# EAGLE board AeroQuad32 (EAGLE 5.11), part 1 of 2
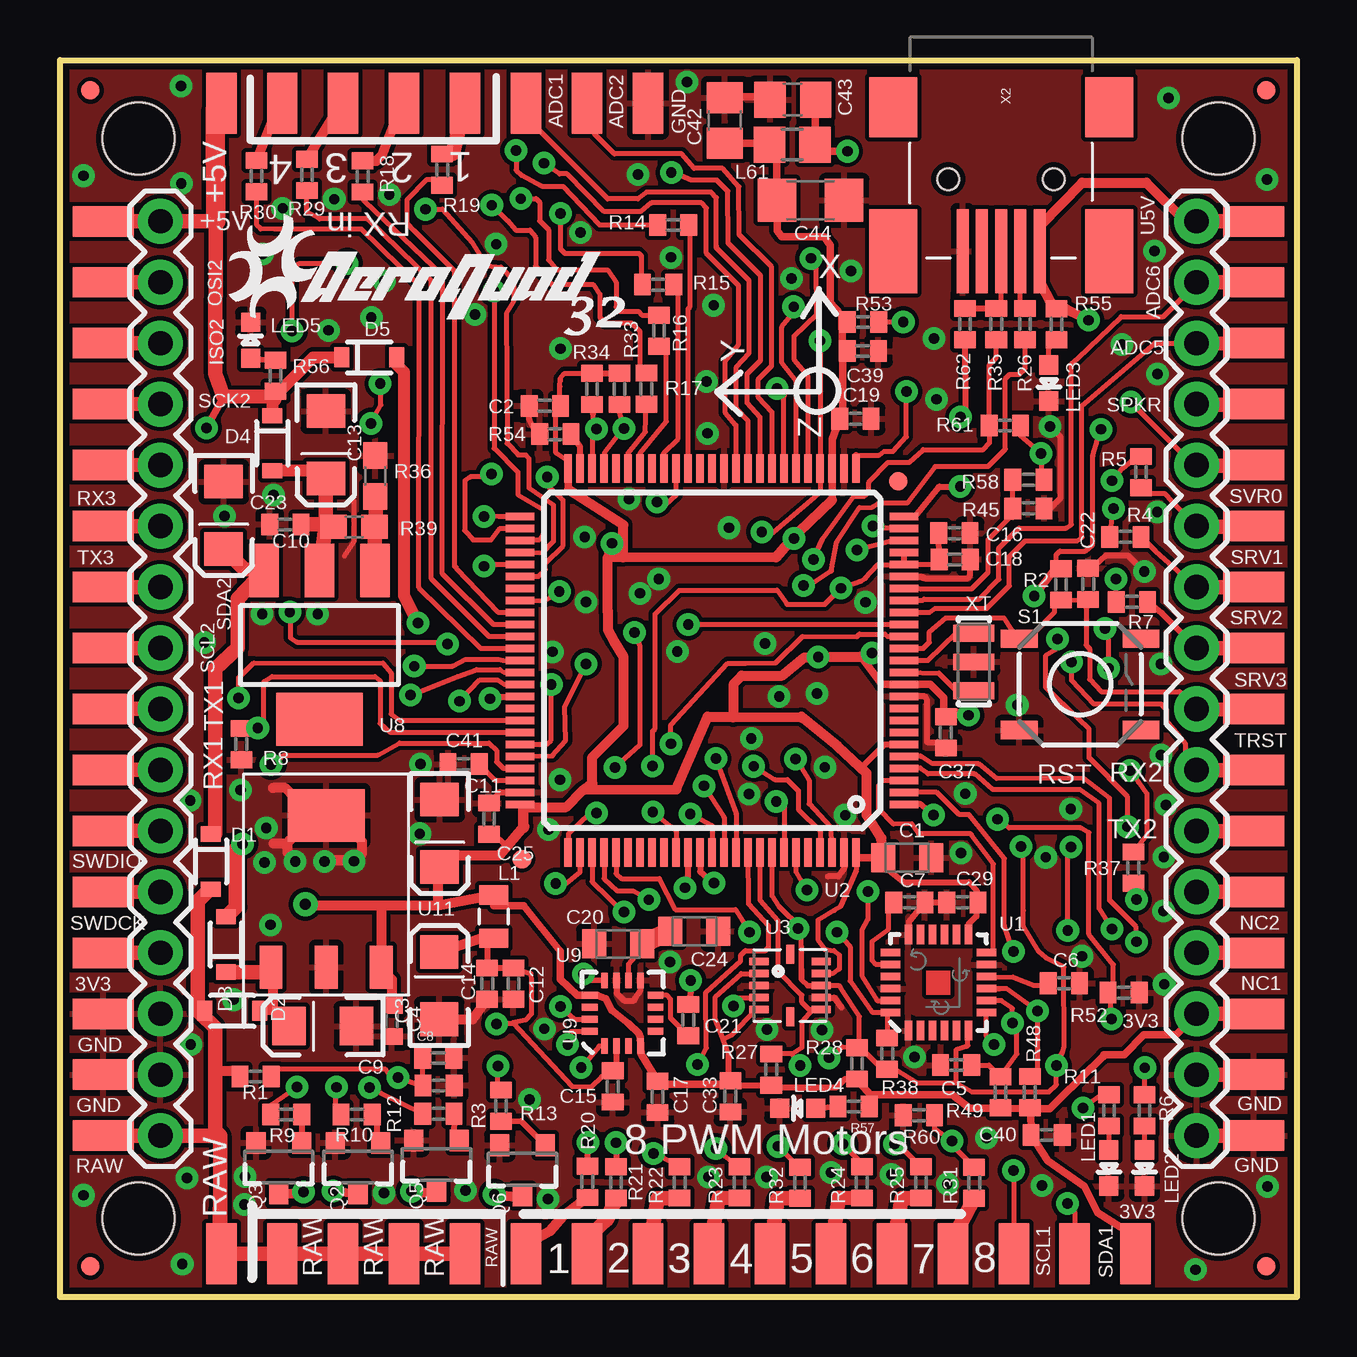
[diagram p1: board, top side]
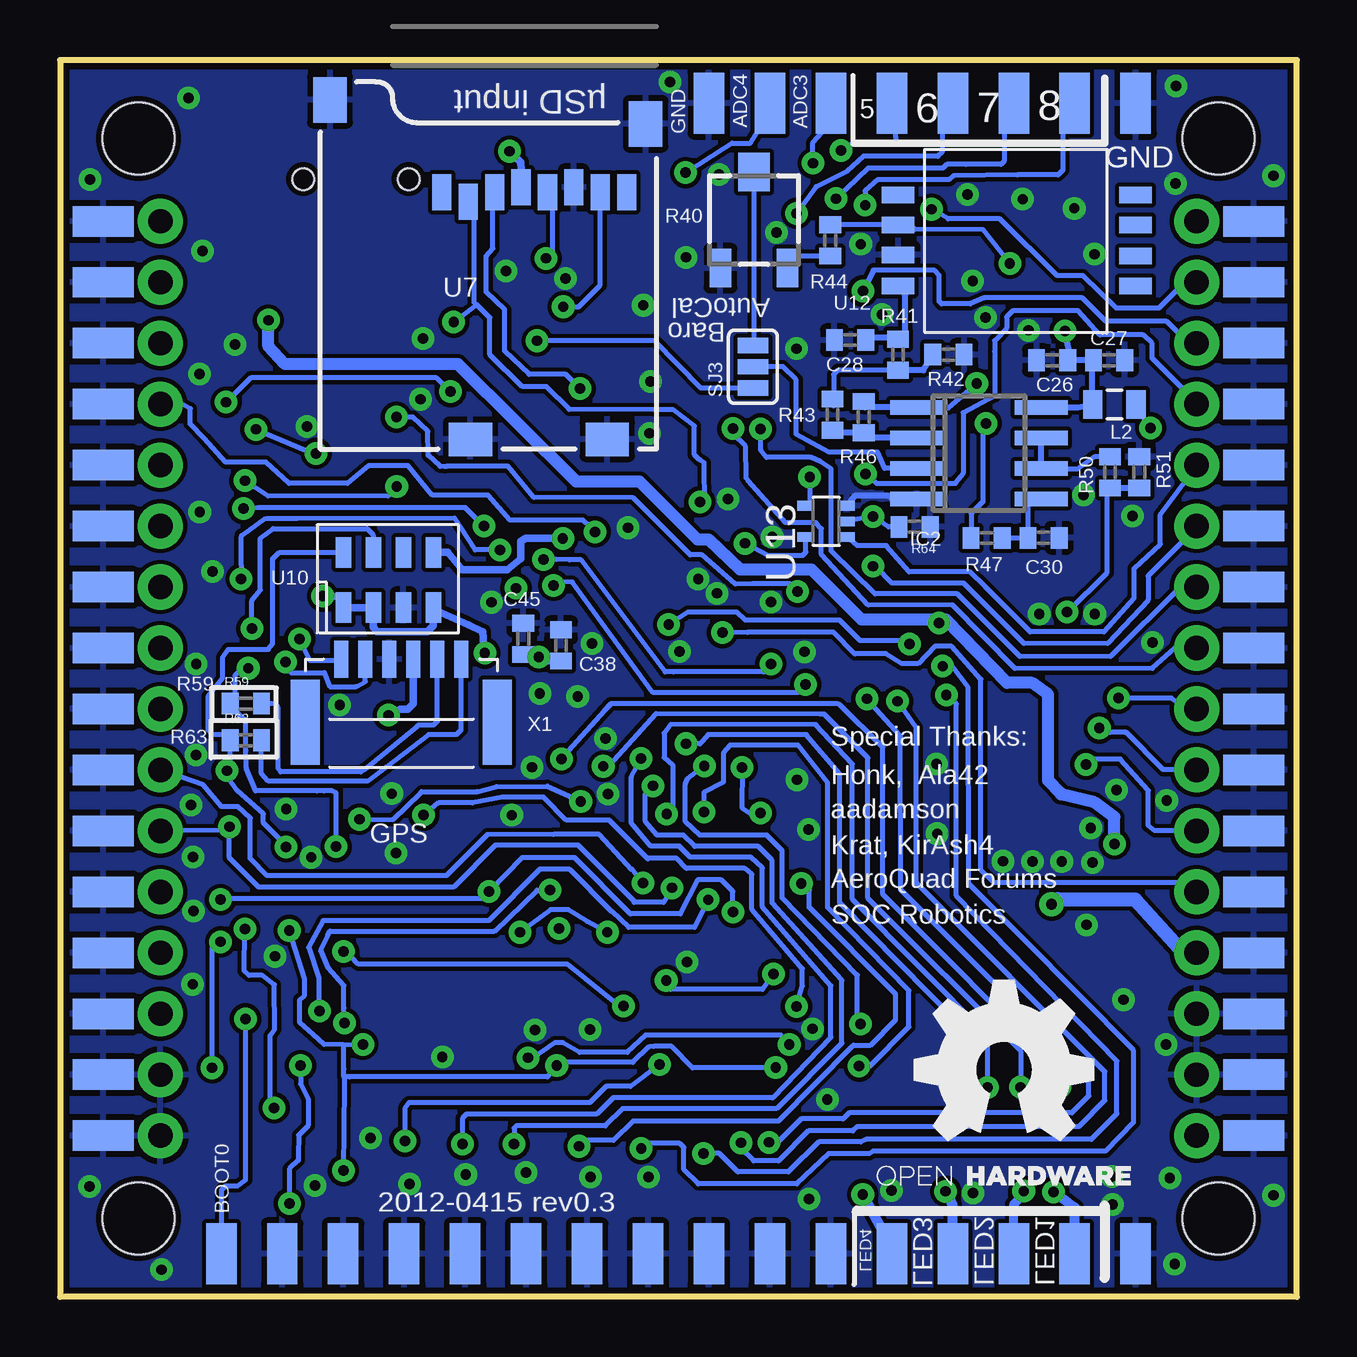
[diagram p2: board, bottom side, seen from below]

Size 51.54 x 51.54 mm. Coordinates in mm from the lower left corner, seen from the top.
Outline: 0,0 0,51.54 51.54,51.54 51.54,0 0,0
Copper layers (1*16): Top 0.0356mm / dielectric 1.5011mm / Bottom 0.0356mm
Design rules "LaenPCBOrder *": minimum track width 8mil, minimum drill 17mil, track to track 7mil, track to pad 7mil, pad to pad 7mil, via to via 7mil, smd to smd 7mil, copper to edge 10mil, drill to drill 6mil, minimum pad ring 10mil, minimum via ring 10mil, stop-mask expansion 4mil, vias tented up to drill 17mil, thermal gap 10mil
Net classes: 0 default: width 0.203 mm; 1 vcc: width 0.254 mm
Holes 3 mm at 3.27,48.27 48.27,48.27 48.27,3.27 3.27,3.27

## Footprints (pad centres in the part's own frame; a part is rotated, then mirrored left to right if it is on the bottom)
SMD1,27-2,54 = smd 1.27 x 2.54: 1 0,0
SMC_Z = smd 1 x 1.2: + -1,0; - 1,0
C0402 = smd 0.7 x 0.9: 1 -0.65,0; 2 0.65,0
EIA3216 = smd 1.4 x 1.6: A 1.4,0; C -1.4,0
C0805 = smd 1.3 x 1.5: 1 -0.95,0; 2 0.95,0
C1206 = smd 1.6 x 1.8: 1 -1.4,0; 2 1.4,0
SOD-323 = smd 0.63 x 0.83: 1 -1.15,0; 2 1.15,0
SO08 = smd 0.6 x 2.2: 1 -1.905,-2.6; 2 -0.635,-2.6; 3 0.635,-2.6; 4 1.905,-2.6; 5 1.905,2.6; 6 0.635,2.6; 7 -0.635,2.6; 8 -1.905,2.6
1X16 = drill 1.016 pad 1.88 round: 1 0,0; 2 2.54,0; 3 5.08,0; 4 7.62,0; 5 10.16,0; 6 12.7,0; 7 15.24,0; 8 17.78,0; 9 20.32,0; 10 22.86,0; 11 25.4,0; 12 27.94,0; 13 30.48,0; 14 33.02,0; 15 35.56,0; 16 38.1,0
0805 = smd 0.8 x 1.2: 1 -0.9,0; 2 0.9,0
R0805 = smd 1.3 x 1.5: 1 -0.95,0; 2 0.95,0
LED-0603 = smd 0.8 x 0.8: A 0,-0.75; C 0,0.75
SOT23-3 = smd 0.8 x 0.9: 1 -0.95,-1; 2 0.95,-1; 3 0,1.1
R0402 = smd 0.7 x 0.9: 1 -0.65,0; 2 0.65,0
0603 = smd 1.1 x 1: 1 -0.85,0; 2 0.85,0
3223J = smd 1.6 x 0.9: 1 -2,1.4; 3 -2,-1.4 | smd 1.6 x 1.3: 2 2,0
TACTILE_SWITCH_SMD = smd 1.524 x 0.762: 1 -2.54,1.905; 2 2.54,1.905; 3 -2.54,-1.905; 4 2.54,-1.905
SJ_3 = smd 0.635 x 1.27: 1 -0.889,0; 2 0,0; 3 0.889,0
QFN-24 = smd 0.8 x 0.3: 1 -2,1.25; 2 -2,0.75; 3 -2,0.25; 4 -2,-0.25; 5 -2,-0.75; 6 -2,-1.25; 13 2,-1.25; 14 2,-0.75; 15 2,-0.25; 16 2,0.25; 17 2,0.75; 18 2,1.25 | smd 0.3 x 0.8: 7 -1.25,-2; 8 -0.75,-2; 9 -0.25,-2; 10 0.25,-2; 11 0.75,-2; 12 1.25,-2; 19 1.25,2; 20 0.75,2; 21 0.25,2; 22 -0.25,2; 23 -0.75,2; 24 -1.25,2
TQFP100 = smd 1.2 x 0.3: 1 -8,6; 2 -8,5.5; 3 -8,5; 4 -8,4.5; 5 -8,4; 6 -8,3.5; 7 -8,3; 8 -8,2.5; 9 -8,2; 10 -8,1.5; 11 -8,1; 12 -8,0.5; 13 -8,0; 14 -8,-0.5; 15 -8,-1; 16 -8,-1.5; 17 -8,-2; 18 -8,-2.5; 19 -8,-3; 20 -8,-3.5; 21 -8,-4; 22 -8,-4.5; 23 -8,-5; 24 -8,-5.5; 25 -8,-6; 51 8,-6; 52 8,-5.5; 53 8,-5; 54 8,-4.5; 55 8,-4; 56 8,-3.5; 57 8,-3; 58 8,-2.5; 59 8,-2; 60 8,-1.5; 61 8,-1; 62 8,-0.5; 63 8,0; 64 8,0.5; 65 8,1; 66 8,1.5; 67 8,2; 68 8,2.5; 69 8,3; 70 8,3.5; 71 8,4; 72 8,4.5; 73 8,5; 74 8,5.5; 75 8,6 | smd 0.3 x 1.2: 26 -6,-8; 27 -5.5,-8; 28 -5,-8; 29 -4.5,-8; 30 -4,-8; 31 -3.5,-8; 32 -3,-8; 33 -2.5,-8; 34 -2,-8; 35 -1.5,-8; 36 -1,-8; 37 -0.5,-8; 38 0,-8; 39 0.5,-8; 40 1,-8; 41 1.5,-8; 42 2,-8; 43 2.5,-8; 44 3,-8; 45 3.5,-8; 46 4,-8; 47 4.5,-8; 48 5,-8; 49 5.5,-8; 50 6,-8; 76 6,8; 77 5.5,8; 78 5,8; 79 4.5,8; 80 4,8; 81 3.5,8; 82 3,8; 83 2.5,8; 84 2,8; 85 1.5,8; 86 1,8; 87 0.5,8; 88 0,8; 89 -0.5,8; 90 -1,8; 91 -1.5,8; 92 -2,8; 93 -2.5,8; 94 -3,8; 95 -3.5,8; 96 -4,8; 97 -4.5,8; 98 -5,8; 99 -5.5,8; 100 -6,8
LGA12 = smd 0.8 x 0.32: P$1 -1.3,1; P$2 -1.3,0.5; P$3 -1.3,0; P$4 -1.3,-0.5; P$5 -1.3,-1; P$7 1.3,-1; P$8 1.3,-0.5; P$9 1.3,0; P$10 1.3,0.5; P$11 1.3,1 | smd 0.32 x 0.8: P$6 0,-1.3; P$12 0,1.3
MICRO-SD-SOCKET-PP = smd 0.8 x 1.5: 1 -8.94,10.7; 2 -7.84,10.3; 3 -6.74,10.7; 4 -5.64,10.9; 5 -4.54,10.7; 6 -3.44,10.9; 7 -2.34,10.7; 8 -1.24,10.7 | smd 1.8 x 1.4: CD1 -2.05,0.4; CD2 -7.75,0.4 | smd 1.4 x 1.9: GND1 -13.6,14.55; GND3 -0.45,13.55
SOT223 = smd 1.219 x 2.235: 1 -2.311,-3.099; 2 0,-3.099; 3 2.311,-3.099 | smd 3.6 x 2.2: 4 0,3.099
16LPCC = smd 0.65 x 0.28: 1 -1.37,0.75; 2 -1.37,0.25; 3 -1.37,-0.25; 4 -1.37,-0.75; 9 1.37,-0.75; 10 1.37,-0.25; 11 1.37,0.25; 12 1.37,0.75 | smd 0.28 x 0.65: 5 -0.75,-1.37; 6 -0.25,-1.37; 7 0.25,-1.37; 8 0.75,-1.37; 13 0.75,1.37; 14 0.25,1.37; 15 -0.25,1.37; 16 -0.75,1.37
LGA08A = smd 1.27 x 0.635: 1 -1.15,1.9; 2 -1.15,0.65; 3 -1.15,-0.6; 4 -1.15,-1.85; 5 1.15,-1.85; 6 1.15,-0.6; 7 1.15,0.65; 8 1.15,1.9
TO-223 = smd 3.2 x 2.2: 1 0,6.311 | smd 0.95 x 1.8: 2 -2.3,-0.014; 3 2.3,-0.014; 4 0,-0.014
MPX_SMD = smd 1.35 x 0.69 bottom: GND -1.1,4.4; P$1 8.8,5.7; P$2 -1.1,1.9; P$3 8.8,4.45; P$4 8.8,3.15; P$5 8.8,1.9; VCC -1.1,3.15; VOUT -1.1,5.7
SC70-5 = smd 0.4 x 0.7: 1 -0.65,-0.85; 2 0,-0.85; 3 0.65,-0.85; 4 0.65,0.85; 5 -0.65,0.85
PAD.03X.03 = smd 0.762 x 0.762: P$1 0,0
6SMT-R = smd 0.6 x 1.55: 1 -2.5,4.75; 2 -1.5,4.75; 3 -0.5,4.75; 4 0.5,4.75; 5 1.5,4.75; 6 2.5,4.75 | smd 1.2 x 1.8: 7 -4,1.25; 8 4,1.25; 9 -4,3; 10 4,3
USB-MINIB-OLD = smd 2.5 x 2: 1 -3,-4.5; 2 -3,4.5 | smd 3.5 x 2: 3 3,-4.5; 4 3,4.5 | smd 3.5 x 0.5: D+ 3,0; D- 3,0.8; GND 3,-1.6; ID 3,-0.8; VBUS 3.01,1.61 | hole 0.9: 0,2.2; 0,-2.2
RESONATOR-SMD = smd 0.7 x 1.7: 1 -1.2,0; 2 0,0; 3 1.2,0

## Placement (x,y rotation side)
1  Ser1  [SMD1,27-2,54]  49.74,21.96 270 bottom
2  Ser1  [SMD1,27-2,54]  49.74,11.8 270 bottom
3  Ser1  [SMD1,27-2,54]  49.74,16.88 270 bottom
4  Ser1  [SMD1,27-2,54]  49.74,37.2 270 bottom
5  Ser1  [SMD1,27-2,54]  49.74,24.5 270 bottom
5+  [SMD1,27-2,54]  6.72,49.74 180 top
6  Ser1  [SMD1,27-2,54]  49.74,27.04 270 bottom
7  Ser1  [SMD1,27-2,54]  49.74,19.42 270 bottom
8  Ser1  [SMD1,27-2,54]  49.74,42.28 270 bottom
9  Ser1  [SMD1,27-2,54]  49.74,34.66 270 bottom
10  Ser1  [SMD1,27-2,54]  49.74,9.26 270 bottom
11  Ser1  [SMD1,27-2,54]  49.74,14.34 270 bottom
12  Ser1  [SMD1,27-2,54]  49.74,29.58 270 bottom
13  Ser1  [SMD1,27-2,54]  49.74,39.74 270 bottom
14  Ser1  [SMD1,27-2,54]  49.74,6.72 270 bottom
15  [SMD1,27-2,54]  49.74,44.82 90 top
16  [SMD1,27-2,54]  1.8,29.58 90 top
17  [SMD1,27-2,54]  1.8,37.2 90 top
18  [SMD1,27-2,54]  1.8,19.42 90 top
19  Ser1  [SMD1,27-2,54]  49.74,44.82 90 bottom
20  Ser1  [SMD1,27-2,54]  21.96,49.74 0 bottom
21  [SMD1,27-2,54]  1.8,27.04 90 top
22  Ser1  [SMD1,27-2,54]  24.5,49.74 0 bottom
23  [SMD1,27-2,54]  1.8,6.72 90 top
24  Ser1  [SMD1,27-2,54]  49.74,32.12 270 bottom
25  [SMD1,27-2,54]  49.74,34.66 90 top
26  [SMD1,27-2,54]  49.74,11.8 90 top
27  [SMD1,27-2,54]  49.74,19.42 90 top
28  Ser1  [SMD1,27-2,54]  49.74,39.74 270 top
29  [SMD1,27-2,54]  49.74,24.5 90 top
30  [SMD1,27-2,54]  49.74,27.04 90 top
31  [SMD1,27-2,54]  49.74,29.58 90 top
32  Ser1  [SMD1,27-2,54]  24.5,49.74 0 top
33  Ser1  [SMD1,27-2,54]  1.8,44.82 270 bottom
34  [SMD1,27-2,54]  1.8,42.28 90 top
35  [SMD1,27-2,54]  1.8,44.82 90 top
36  [SMD1,27-2,54]  1.8,32.12 90 top
37  [SMD1,27-2,54]  1.8,34.66 90 top
38  [SMD1,27-2,54]  1.8,39.74 90 top
39  [SMD1,27-2,54]  1.8,16.88 90 top
41  [SMD1,27-2,54]  11.8,1.8 180 bottom
42  [SMD1,27-2,54]  16.88,1.8 180 bottom
43  [SMD1,27-2,54]  9.26,1.8 180 bottom
44  [SMD1,27-2,54]  14.34,1.8 180 bottom
45  [SMD1,27-2,54]  49.74,21.96 90 top
46  [SMD1,27-2,54]  49.74,32.12 90 top
47  [SMD1,27-2,54]  49.74,42.28 90 top
48  [SMD1,27-2,54]  1.8,9.26 90 top
49  [SMD1,27-2,54]  1.8,14.34 90 top
50  [SMD1,27-2,54]  1.8,11.8 90 top
51  [SMD1,27-2,54]  1.8,21.96 90 top
53  Ser1  [SMD1,27-2,54]  1.8,14.34 270 bottom
54  Ser1  [SMD1,27-2,54]  21.96,49.74 180 top
55  [SMD1,27-2,54]  39.74,1.8 180 top
56  [SMD1,27-2,54]  42.28,1.8 180 top
57  [SMD1,27-2,54]  49.74,14.34 90 top
58  [SMD1,27-2,54]  49.74,16.88 90 top
59  Ser1  [SMD1,27-2,54]  19.42,49.74 180 top
60  [SMD1,27-2,54]  1.8,24.5 90 top
61  Ser1  [SMD1,27-2,54]  1.8,19.42 270 bottom
62  Ser1  [SMD1,27-2,54]  1.8,27.04 270 bottom
63  Ser1  [SMD1,27-2,54]  49.74,37.2 270 top
64  Ser1  [SMD1,27-2,54]  1.8,24.5 270 bottom
65  Ser1  [SMD1,27-2,54]  1.8,34.66 270 bottom
66  Ser1  [SMD1,27-2,54]  1.8,21.96 270 bottom
67  Ser1  [SMD1,27-2,54]  1.8,37.2 270 bottom
68  Ser1  [SMD1,27-2,54]  1.8,11.8 270 bottom
69  Ser1  [SMD1,27-2,54]  1.8,29.58 270 bottom
70  Ser1  [SMD1,27-2,54]  1.8,32.12 270 bottom
71  Ser1  [SMD1,27-2,54]  1.8,9.26 270 bottom
72  Ser1  [SMD1,27-2,54]  1.8,6.72 270 bottom
73  Ser1  [SMD1,27-2,54]  1.8,16.88 270 bottom
74  Ser1  [SMD1,27-2,54]  1.8,42.28 270 bottom
75  Ser1  [SMD1,27-2,54]  1.8,39.74 270 bottom
76  Ser1  [SMD1,27-2,54]  11.8,1.8 0 top
77  Ser1  [SMD1,27-2,54]  16.88,1.8 0 top
78  Ser1  [SMD1,27-2,54]  29.58,1.8 0 bottom
79  Ser1  [SMD1,27-2,54]  21.96,1.8 0 bottom
80  Ser1  [SMD1,27-2,54]  27.04,1.8 0 bottom
81  Ser1  [SMD1,27-2,54]  37.2,1.8 0 bottom
82  Ser1  [SMD1,27-2,54]  34.66,1.8 0 bottom
83  Ser1  [SMD1,27-2,54]  42.28,1.8 0 bottom
84  Ser1  [SMD1,27-2,54]  6.72,49.74 0 bottom
85  Ser1  [SMD1,27-2,54]  44.82,1.8 0 top
86  Ser1  [SMD1,27-2,54]  6.72,1.8 0 bottom
87  Ser1  [SMD1,27-2,54]  32.12,1.8 0 bottom
88  Ser1  [SMD1,27-2,54]  14.34,1.8 0 top
89  Ser1  [SMD1,27-2,54]  19.42,1.8 0 bottom
90  Ser1  [SMD1,27-2,54]  39.74,1.8 0 bottom
91  Ser1  [SMD1,27-2,54]  24.5,1.8 0 bottom
92  Ser1  [SMD1,27-2,54]  9.26,1.8 0 top
102  Ser1  [SMD1,27-2,54]  19.42,49.74 0 bottom
108  [SMD1,27-2,54]  49.74,9.26 90 top
109  [SMD1,27-2,54]  49.74,6.72 90 top
110  [SMD1,27-2,54]  44.82,1.8 0 bottom
B+  [SMD1,27-2,54]  6.72,1.8 0 top
C1  10uF  [SMC_Z]  35.3,18.3 0 top
C2  0.1uF  [C0402]  20.2,37.13 180 top
C3  10uF  [EIA3216]  15.8,12.97 90 top
C4  0.1uF  [C0402]  13.83,11.51 270 top
C5  10nF  [C0402]  37.34,9.66 180 top
C6  0.1uF  [C0402]  41.83,13.07 0 top
C7  2.2nF  [C0402]  35.39,16.44 0 top
C8  0.1µF  [C0402]  15.76,9.96 0 top
C9  10uF (25V)  [EIA3216]  10.95,11.28 180 top
C10  0.1uF  [C0402]  9.39,32.19 180 top
C11  10uF  [EIA3216]  15.82,19.32 270 top
C12  0.1uF  [C0402]  18.89,13.06 270 top
C13  10uF  [EIA3216]  11.08,35.51 270 top
C14  1uF  [C0402]  17.8,13.06 270 top
C15  0.1uF  [C0402]  23.03,8.77 270 top
C16  1uF  [C0402]  37.27,31.83 0 top
C17  0.1uF  [C0402]  24.9,8.34 270 top
C18  10nF  [C0402]  37.28,30.73 0 top
C19  0.1uF  [C0402]  33.14,36.59 0 top
C20  1uF (ESR)  [SMC_Z]  23.25,14.71 180 top
C21  0.22uF  [C0402]  26.18,11.54 90 top
C22  0.1uF  [C0402]  42.84,29.71 270 top
C23  10uF (25V)  [EIA3216]  6.82,32.57 270 top
C24  1uF (ESR)  [SMC_Z]  26.44,15.24 0 top
C25  0.1uF  [C0402]  17.87,19.93 90 top
C26  0.1uF  [C0402]  10.2,39.03 180 bottom
C27  1uF  [C0402]  7.83,39.03 0 bottom
C28  470pF  [C0402]  18.62,39.87 180 bottom
C29  0.1uF  [C0402]  37.6,16.44 180 top
C30  1uF  [C0402]  10.56,31.63 0 bottom
C33  0.1uF  [C0402]  27.93,8.36 270 top
C37  0.1uF  [C0402]  36.91,23.52 270 top
C38  0.1uF  [C0402]  30.67,27.15 90 bottom
C39  0.1uF  [C0402]  33.45,39.41 0 top
C40  0.1uF  [C0402]  41.11,6.75 0 top
C41  2.2uF  [C0402]  16.82,22.2 180 top
C42  220uF  [C0805]  27.7,49.02 90 top
C43  10uF  [C0805]  30.53,49.89 180 top
C44  47uF  [C1206]  31.27,45.69 0 top
C45  0.1uF  [C0402]  32.24,27.42 90 bottom
CH1  [SMD1,27-2,54]  16.88,49.74 180 bottom
CH2  [SMD1,27-2,54]  14.34,49.74 180 bottom
CH3  [SMD1,27-2,54]  11.8,49.74 180 bottom
CH4  [SMD1,27-2,54]  9.26,49.74 180 bottom
CH5  [SMD1,27-2,54]  16.88,49.74 180 top
CH6  [SMD1,27-2,54]  14.34,49.74 180 top
CH7  [SMD1,27-2,54]  11.8,49.74 180 top
CH8  [SMD1,27-2,54]  9.26,49.74 180 top
D1  [SOD-323]  6.29,18.14 270 top
D2  [SOD-323]  7.18,11.92 180 top
D3  [SOD-323]  6.92,14.69 90 top
D4  [SOD-323]  8.85,35.57 270 top
D5  [SOD-323]  12.89,39.15 0 top
IC2  TS922IN  [SO08]  13.25,35.16 270 bottom
JP4  M16PTH  [1X16]  4.18,6.72 90 top
JP5  M16PTH  [1X16]  47.36,6.72 90 top
L1  100uH  [0805]  18.07,15.85 270 top
L2  100uH  [0805]  7.61,37.19 180 bottom
L61  [R0805]  30.51,48.01 0 top
LED1  Blue  [LED-0603]  43.7,5.37 180 top
LED2  Green  [LED-0603]  45.19,5.37 180 top
LED3  Blue  [LED-0603]  41.2,38.08 180 top
LED4  Blue  [LED-0603]  30.74,7.86 90 top
LED5  Blue  [LED-0603]  7.94,39.86 0 top
MOT1  [SMD1,27-2,54]  19.42,1.8 180 top
MOT2  [SMD1,27-2,54]  21.96,1.8 180 top
MOT3  [SMD1,27-2,54]  24.5,1.8 180 top
MOT4  [SMD1,27-2,54]  27.04,1.8 180 top
MOT5  [SMD1,27-2,54]  32.12,1.8 180 top
MOT6  [SMD1,27-2,54]  34.66,1.8 180 top
MOT7  [SMD1,27-2,54]  37.2,1.8 180 top
MOT8  [SMD1,27-2,54]  29.58,1.8 180 top
Q2  BCV27  [SOT23-3]  12.42,5.42 180 top
Q3  BCV27  [SOT23-3]  9.12,5.42 180 top
Q5  BCV27  [SOT23-3]  15.69,5.52 180 top
Q6  BCV27  [SOT23-3]  19.27,5.32 180 top
R1  10K  [C0402]  8.15,9.19 180 top
R2  10K  [C0402]  41.71,29.69 90 top
R3  1k5  [C0402]  15.77,8.81 180 top
R4  1K  [C0402]  44.39,31.67 180 top
R5  1K  [C0402]  45.04,34.37 90 top
R6  294R  [C0402]  45.19,7.77 270 top
R7  1K  [C0402]  44.66,28.96 180 top
R8  10k  [R0402]  7.56,23.04 90 top
R9  1k69  [C0402]  9.43,7.6 0 top
R10  1k69  [C0402]  12.36,7.6 0 top
R11  294R  [C0402]  43.7,7.77 90 top
R12  1k69  [C0402]  15.77,7.63 0 top
R13  1k69  [C0402]  18.37,7.97 270 top
R14  1K  [C0402]  25.55,44.67 0 top
R15  1K  [C0402]  24.92,42.18 0 top
R16  1K  [C0402]  24.96,40.26 270 top
R17  1K  [C0402]  24.43,37.85 270 top
R18  1K  [C0402]  12.61,46.69 270 top
R19  1K  [C0402]  15.92,46.97 270 top
R20  1K  [C0402]  21.97,4.8 90 top
R21  1K  [C0402]  23.17,4.77 90 top
R22  1K  [C0402]  25.82,4.77 90 top
R23  1K  [C0402]  28.31,4.77 90 top
R24  1K  [C0402]  33.41,4.77 90 top
R25  1K  [C0402]  35.87,4.77 90 top
R26  22R  [C0402]  40.21,40.54 90 top
R27  4k7  [C0402]  29.64,9.48 90 top
R28  4k7  [C0402]  33.2,9.73 90 top
R29  1K  [C0402]  10.29,46.76 270 top
R30  1K  [C0402]  8.19,46.71 270 top
R31  1K  [C0402]  38.09,4.76 90 top
R32  1K  [C0402]  30.83,4.76 90 top
R33  4k7  [C0402]  23.32,37.84 270 top
R34  4k7  [C0402]  22.17,37.84 270 top
R35  22R  [C0402]  39.01,40.54 90 top
R36  732 (eff.)  [0603]  13.13,34.21 270 top
R37  0R  [R0402]  44.72,17.89 90 top
R38  0R  [R0402]  34.47,10.14 270 top
R39  243 (eff.)  [0603]  12.25,32.08 180 top
R40  10k  [3223J]  22.62,44.87 90 bottom
R41  5k6  [C0402]  16.62,39.26 270 bottom
R42  10k  [C0402]  14.52,39.26 180 bottom
R43  6k8  [C0402]  19.35,36.76 270 bottom
R44  10k  [C0402]  19.45,44.02 90 bottom
R45  0R  [R0402]  40.35,32.86 180 top
R46  1M  [C0402]  18.05,36.66 90 bottom
R47  6k8  [C0402]  12.93,31.62 0 bottom
R48  4k7  [C0402]  40.41,8.53 90 top
R49  4k7  [C0402]  39.18,8.53 90 top
R50  5k6  [C0402]  7.79,34.36 90 bottom
R51  10k  [C0402]  6.57,34.36 270 bottom
R52  10K  [C0402]  44.32,12.68 180 top
R53  4k7  [C0402]  33.46,40.62 0 top
R54  0k  [C0402]  20.64,35.95 0 top
R55  377R  [C0402]  41.52,40.53 90 top
R56  377R  [C0402]  8.98,38.38 270 top
R57  294R  [C0402]  33.07,7.94 180 top
R58  0R  [R0402]  40.35,34.05 180 top
R59  0R  [C0402]  43.8,24.72 0 bottom
R60  10k  [R0402]  35.79,7.57 180 top
R61  1K5  [R0402]  39.37,36.31 180 top
R62  220R  [C0402]  37.71,40.54 270 top
R63  0R  [C0402]  43.8,23.2 0 bottom
R64  10K  [C0402]  15.93,32.09 180 bottom
S1  SW-MOM  [TACTILE_SWITCH_SMD]  42.51,25.52 0 top
SJ3  [SJ_3]  22.67,38.76 90 bottom
U1  ITG-3200  [QFN-24]  36.6,13.1 90 top
U2  STM32F10XVXT6  [TQFP100]  27.17,26.52 180 top
U3  BMA180  [LGA12]  30.42,12.97 0 top
U7  USD-SOCKETNEW  [MICRO-SD-SOCKET-PP]  26.69,35.33 0 bottom
U8  317  [SOT223]  10.82,27.17 180 top
U9  HMC5883LSMD  [16LPCC]  23.44,11.82 90 top
U10  MS5611  [LGA08A]  37.83,29.87 90 bottom
U11  MIC5239  [TO-223]  11.09,13.75 0 top
U12  MPX_SMD  [MPX_SMD]  15.52,47.82 180 top
U13  74AHC1G86DCK  [SC70-5]  19.62,32.32 90 bottom
U$4  [AQ-WORDS-PT07]  7.03,39.72 0 top
U$5  [OSHW_TEXT]  17.5,4.65 0 bottom
U$7  PAD.03  [PAD.03X.03]  1.27,1.27 0 top
U$9  PAD.03  [PAD.03X.03]  50.27,1.27 0 top
U$10  PAD.03  [PAD.03X.03]  1.27,50.27 0 top
U$11  PAD.03  [PAD.03X.03]  50.27,50.27 0 top
U$12  PAD.03  [PAD.03X.03]  19.25,18.24 0 top
U$13  PAD.03  [PAD.03X.03]  34.93,33.99 0 top
X1  06FLZ-SM1  [6SMT-R]  37.32,21.83 0 bottom
X2  USBOLD  [USB-MINIB-OLD]  39.21,46.58 270 top
XT  8MHz  [RESONATOR-SMD]  38.08,26.46 270 top